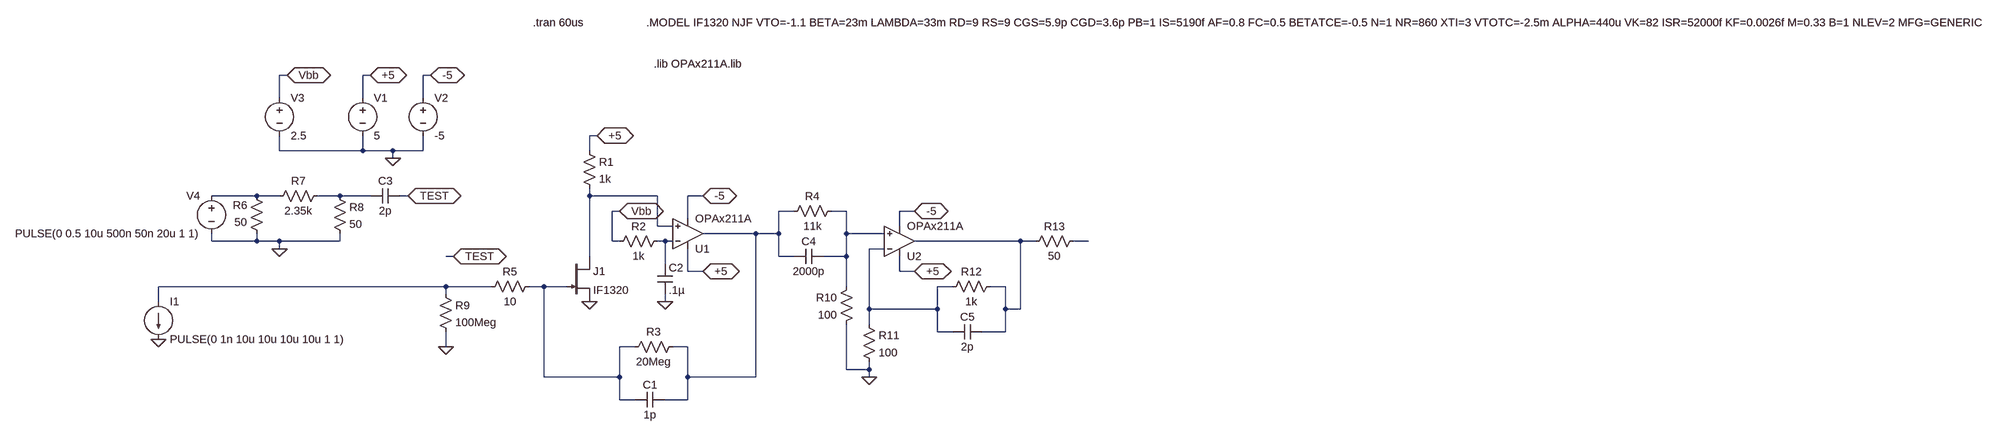
[diagram p0: schematic SAQ_SPICE_bad.asc]
SAQ_SPICE_bad.asc, the LTspice schematic file:
Version 4
SHEET 1 2764 1256
WIRE -752 160 -768 160
WIRE -576 160 -592 160
WIRE -448 160 -464 160
WIRE -768 208 -768 160
WIRE -592 208 -592 160
WIRE -464 208 -464 160
WIRE -96 288 -112 288
WIRE -768 320 -768 288
WIRE -592 320 -592 288
WIRE -592 320 -768 320
WIRE -528 320 -592 320
WIRE -464 320 -464 288
WIRE -464 320 -528 320
WIRE -112 320 -112 288
WIRE -528 336 -528 320
WIRE -816 416 -912 416
WIRE -768 416 -816 416
WIRE -640 416 -688 416
WIRE -576 416 -640 416
WIRE -496 416 -512 416
WIRE -112 416 -112 400
WIRE 32 416 -112 416
WIRE 128 416 96 416
WIRE -48 448 -64 448
WIRE 320 448 288 448
WIRE 432 448 400 448
WIRE 576 448 544 448
WIRE 96 464 96 416
WIRE 32 480 32 416
WIRE 64 480 32 480
WIRE 544 480 544 448
WIRE 240 496 128 496
WIRE 288 496 288 448
WIRE 288 496 240 496
WIRE 432 496 432 448
WIRE 512 496 432 496
WIRE -912 512 -912 496
WIRE -816 512 -816 496
WIRE -816 512 -912 512
WIRE -768 512 -816 512
WIRE -640 512 -640 496
WIRE -640 512 -768 512
WIRE -64 512 -64 448
WIRE -48 512 -64 512
WIRE 48 512 32 512
WIRE 64 512 48 512
WIRE 800 512 576 512
WIRE 832 512 800 512
WIRE 944 512 912 512
WIRE -768 528 -768 512
WIRE 512 528 480 528
WIRE -400 544 -416 544
WIRE -112 544 -112 416
WIRE 288 544 288 496
WIRE 320 544 288 544
WIRE 432 544 432 496
WIRE 432 544 384 544
WIRE 48 560 48 512
WIRE 96 576 96 528
WIRE 128 576 96 576
WIRE 544 576 544 544
WIRE 576 576 544 576
WIRE -416 608 -1024 608
WIRE -320 608 -416 608
WIRE -208 608 -240 608
WIRE -160 608 -208 608
WIRE 432 608 432 544
WIRE 656 608 624 608
WIRE 768 608 736 608
WIRE -416 624 -416 608
WIRE -1024 640 -1024 608
WIRE 48 640 48 624
WIRE 480 656 480 528
WIRE 624 656 624 608
WIRE 624 656 480 656
WIRE 768 656 768 608
WIRE 800 656 800 512
WIRE 800 656 768 656
WIRE 480 688 480 656
WIRE 624 704 624 656
WIRE 656 704 624 704
WIRE 768 704 768 656
WIRE 768 704 720 704
WIRE -416 736 -416 704
WIRE -16 736 -48 736
WIRE 96 736 64 736
WIRE 432 784 432 688
WIRE 480 784 480 768
WIRE 480 784 432 784
WIRE -208 800 -208 608
WIRE -48 800 -48 736
WIRE -48 800 -208 800
WIRE 96 800 96 736
WIRE 240 800 240 496
WIRE 240 800 96 800
WIRE 480 800 480 784
WIRE -48 848 -48 800
WIRE -16 848 -48 848
WIRE 96 848 96 800
WIRE 96 848 48 848
FLAG -528 336 0
FLAG -576 160 +5
IOPIN -576 160 BiDir
FLAG -448 160 -5
IOPIN -448 160 BiDir
FLAG -96 288 +5
IOPIN -96 288 BiDir
FLAG -112 640 0
FLAG -752 160 Vbb
IOPIN -752 160 BiDir
FLAG -48 448 Vbb
IOPIN -48 448 BiDir
FLAG 128 416 -5
IOPIN 128 416 BiDir
FLAG 128 576 +5
IOPIN 128 576 BiDir
FLAG -496 416 TEST
IOPIN -496 416 BiDir
FLAG -768 528 0
FLAG -416 736 0
FLAG -400 544 TEST
IOPIN -400 544 BiDir
FLAG 48 640 0
FLAG 576 576 +5
IOPIN 576 576 BiDir
FLAG 576 448 -5
IOPIN 576 448 BiDir
FLAG 480 800 0
FLAG -1024 720 0
SYMBOL njf -160 544 R0
SYMATTR InstName J1
SYMATTR Value IF1320
SYMBOL voltage -592 192 R0
SYMATTR InstName V1
SYMATTR Value 5
SYMBOL voltage -464 192 R0
SYMATTR InstName V2
SYMATTR Value -5
SYMBOL res -128 304 R0
SYMATTR InstName R1
SYMATTR Value 1k
SYMBOL voltage -768 192 R0
SYMATTR InstName V3
SYMATTR Value 2.5
SYMBOL res 48 496 R90
WINDOW 0 0 56 VBottom 2
WINDOW 3 32 56 VTop 2
SYMATTR InstName R2
SYMATTR Value 1k
SYMBOL res 80 720 R90
WINDOW 0 0 56 VBottom 2
WINDOW 3 32 56 VTop 2
SYMATTR InstName R3
SYMATTR Value 20Meg
SYMBOL cap 48 832 R90
WINDOW 0 0 32 VBottom 2
WINDOW 3 32 32 VTop 2
SYMATTR InstName C1
SYMATTR Value 1p
SYMBOL res -224 592 R90
WINDOW 0 0 56 VBottom 2
WINDOW 3 32 56 VTop 2
SYMATTR InstName R5
SYMATTR Value 10
SYMBOL res -800 512 R180
WINDOW 0 36 76 Left 2
WINDOW 3 36 40 Left 2
SYMATTR InstName R6
SYMATTR Value 50
SYMBOL res -784 432 R270
WINDOW 0 32 56 VTop 2
WINDOW 3 0 56 VBottom 2
SYMATTR InstName R7
SYMATTR Value 2.35k
SYMBOL res -656 400 R0
SYMATTR InstName R8
SYMATTR Value 50
SYMBOL voltage -912 400 M0
SYMATTR InstName V4
SYMATTR Value PULSE(0 0.5 10u 500n 50n 20u 1 1)
SYMBOL res -432 608 R0
SYMATTR InstName R9
SYMATTR Value 100Meg
SYMBOL cap 32 560 R0
SYMATTR InstName C2
SYMATTR Value .1µ
SYMBOL cap -512 400 R90
WINDOW 0 0 32 VBottom 2
WINDOW 3 32 32 VTop 2
SYMATTR InstName C3
SYMATTR Value 2p
SYMBOL res 416 432 R90
WINDOW 0 0 56 VBottom 2
WINDOW 3 32 56 VTop 2
SYMATTR InstName R4
SYMATTR Value 11k
SYMBOL cap 384 528 R90
WINDOW 0 0 32 VBottom 2
WINDOW 3 32 32 VTop 2
SYMATTR InstName C4
SYMATTR Value 2000p
SYMBOL res 448 592 M0
SYMATTR InstName R10
SYMATTR Value 100
SYMBOL res 464 672 R0
SYMATTR InstName R11
SYMATTR Value 100
SYMBOL res 752 592 R90
WINDOW 0 0 56 VBottom 2
WINDOW 3 32 56 VTop 2
SYMATTR InstName R12
SYMATTR Value 1k
SYMBOL cap 720 688 R90
WINDOW 0 0 32 VBottom 2
WINDOW 3 32 32 VTop 2
SYMATTR InstName C5
SYMATTR Value 2p
SYMBOL res 928 496 R90
WINDOW 0 0 56 VBottom 2
WINDOW 3 32 56 VTop 2
SYMATTR InstName R13
SYMATTR Value 50
SYMBOL OpAmps/opamp2 96 560 M180
SYMATTR InstName U1
SYMATTR Value OPAx211A
SYMBOL OpAmps/opamp2 544 576 M180
SYMATTR InstName U2
SYMATTR Value OPAx211A
SYMBOL current -1024 640 R0
SYMATTR InstName I1
SYMATTR Value PULSE(0 1n 10u 10u 10u 10u 1 1)
TEXT 8 48 Left 2 !.MODEL IF1320 NJF VTO=-1.1 BETA=23m LAMBDA=33m RD=9 RS=9 CGS=5.9p CGD=3.6p PB=1 IS=5190f AF=0.8 FC=0.5 BETATCE=-0.5 N=1 NR=860 XTI=3 VTOTC=-2.5m ALPHA=440u VK=82 ISR=52000f KF=0.0026f M=0.33 B=1 NLEV=2 MFG=GENERIC
TEXT 24 136 Left 2 !.lib OPAx211A.lib
TEXT -232 48 Left 2 !.tran 60us

The netlist it stands for:
* SAQ_SPICE_bad.asc
J1 N003 N011 0 IF1320
V1 +5 0 5
V2 -5 0 -5
R1 +5 N003 1k
V3 Vbb 0 2.5
R2 N006 Vbb 1k
R3 N004 N011 20Meg
C1 N004 N011 1p
R5 N011 N010 10
R6 0 N001 50
R7 N001 N002 2.35k
R8 N002 0 50
V4 N001 0 PULSE(0 0.5 10u 500n 50n 20u 1 1)
R9 N010 0 100Meg
C2 N006 0 .1µ
C3 TEST N002 2p
R4 N005 N004 11k
C4 N005 N004 2000p
R10 N005 0 100
R11 N009 0 100
R12 N007 N009 1k
C5 N007 N009 2p
R13 N008 N007 50
XU1 N003 N006 +5 -5 N004 OPAx211A  ; pins In+ In- V+ V- OUT
XU2 N005 N009 +5 -5 N007 OPAx211A  ; pins In+ In- V+ V- OUT
I1 N010 0 PULSE(0 1n 10u 10u 10u 10u 1 1)
.model NJF NJF
.model PJF PJF
.lib standard.jft
.MODEL IF1320 NJF VTO=-1.1 BETA=23m LAMBDA=33m RD=9 RS=9 CGS=5.9p CGD=3.6p PB=1 IS=5190f AF=0.8 FC=0.5 BETATCE=-0.5 N=1 NR=860 XTI=3 VTOTC=-2.5m ALPHA=440u VK=82 ISR=52000f KF=0.0026f M=0.33 B=1 NLEV=2 MFG=GENERIC
.lib OPAx211A.lib
.tran 60us
.backanno
.end